# Altium schematic sheet HDMI.SchDoc
size A3; PageSetup: Record=PageOptions|CenterHorizontal=True|CenterVertical=True|PrintScale=0.73|XCorrection=1.00|YCorrection=1.00|PrintKind=0|BorderSize=5000000|LeftOffset=0|BottomOffset=0|Orientation=2|PaperLength=1000|PaperWidth=1000|Scale=100|PaperSource=7|PrintQuality=-4|MediaType=1|DitherType=10|PaperKind=A4|PrintScaleMode=1; Date: 27.05.2014; DrawnBy: luths8; Organization: BFH; Address1: Bern University of Applied Sciences; Address2: Engineering and Information Technology; Address3: Jlcoweg 1; Address4: CH-3400 Burgdorf; DocumentNumber: 10; Revision: 1.1; SheetNumber: 10; SheetTotal: 16; CurrentDate: 27.05.2014
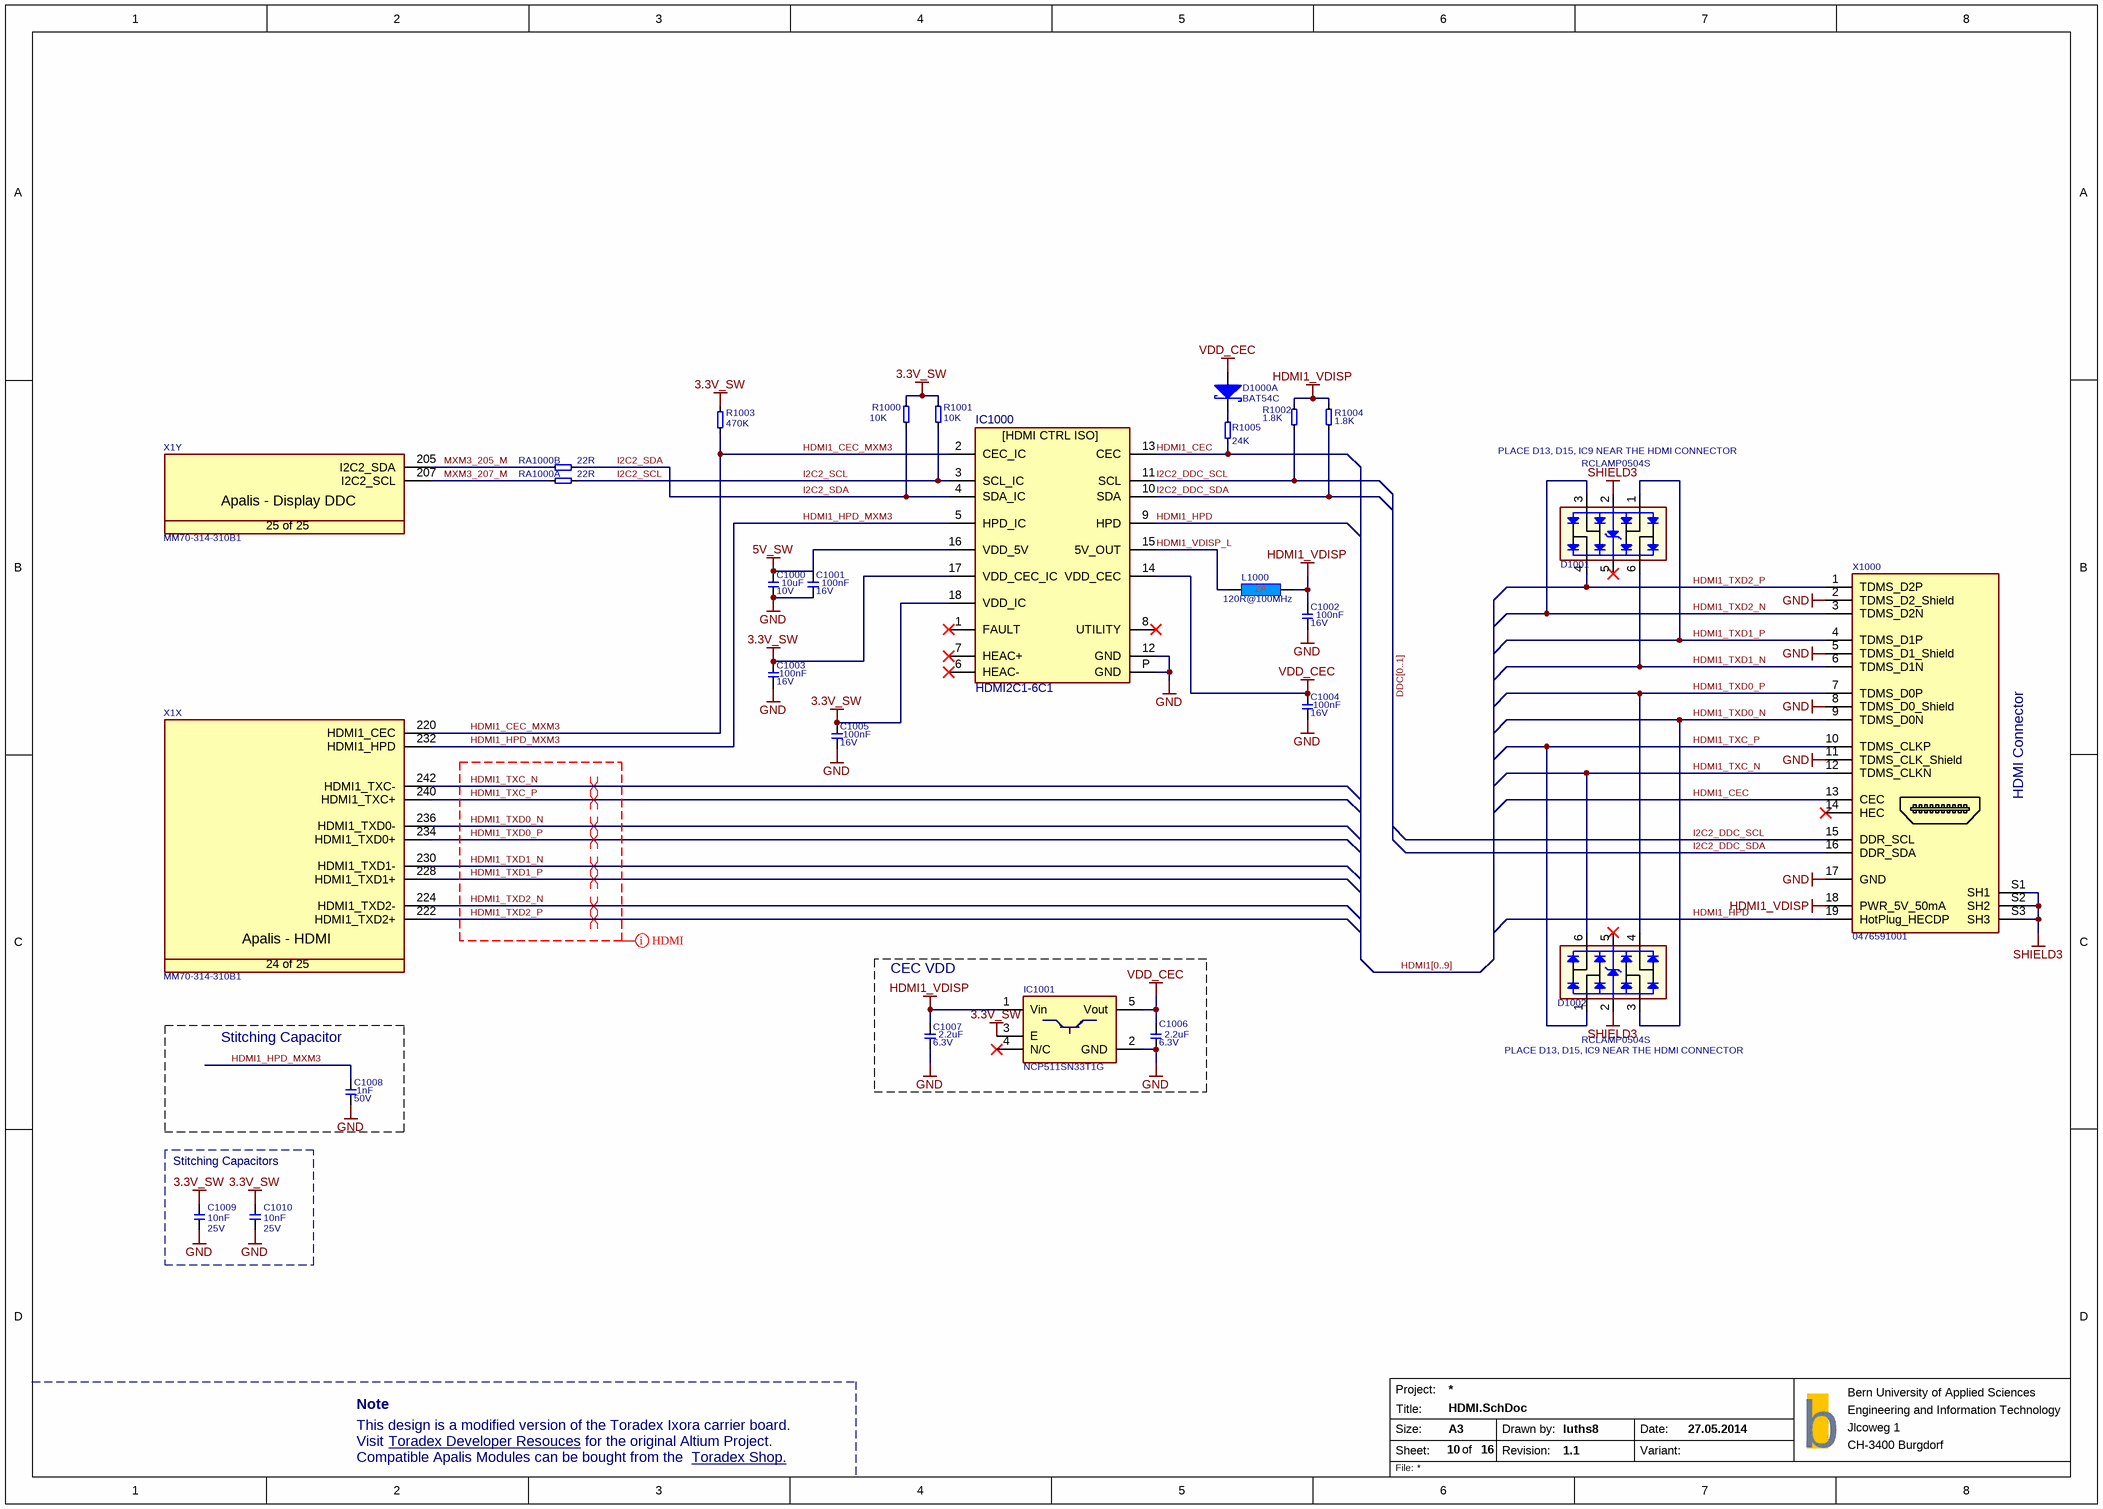
[diagram p0: HDMI.SchDoc]

## Parts
C1000  Rating: 10V  [SMD0603CAP]  (hidden comment: 10uF)
C1001  Rating: 16V  [SMD0603CAP]  (hidden comment: 100nF)
C1002  Rating: 16V  [SMD0603CAP]  (hidden comment: 100nF)
C1003  Rating: 16V  [SMD0603CAP]  (hidden comment: 100nF)
C1004  Rating: 16V  [SMD0603CAP]  (hidden comment: 100nF)
C1005  Rating: 16V  [SMD0603CAP]  (hidden comment: 100nF)
C1006  Rating: 6.3V  [SMD0603CAP]  (hidden comment: 2.2uF)
C1007  Rating: 6.3V  [SMD0603CAP]  (hidden comment: 2.2uF)
C1008  Rating: 50V  [SMD0603CAP]  (hidden comment: 1nF)
C1009  10nF  Rating: 25V  [SMD0603CAP]
C1010  10nF  Rating: 25V  [SMD0603CAP]
D1000  BAT54C  [SOT95P230X110-3N]  (part A of 2)
D1001  RCLAMP0504S  [T_SOT95P285X90-6N]
D1002  RCLAMP0504S  [T_SOT95P285X90-6N]
IC1000  HDMI2C1-6C1  [QFN18]
IC1001  NCP511SN33T1G  [SOT95P279X142-5N]
L1000  120R@100MHz  [INDC1608X95N]
R1000  10K  [SMD0603RES]
R1001  10K  [SMD0603RES]
R1002  1.8K  [SMD0603RES]
R1003  470K  [SMD0603RES]
R1004  1.8K  [SMD0603RES]
R1005  24K  [SMD0603RES]
RA1000  22R  [T_Resistor_Array_X4]  (parts A,B of 4)
X1  Manufacturer Part No.: MM70-314-310B1  [T_JAE_MM70-314-310B1]  (hidden comment: CON-JAE-MM70-314-310B1-314-0.5mm)  (parts X,Y of 25)
X1000  0476591001  [0476591001]

## Blocks framed on the sheet
CEC VDD: C1006 C1007 IC1001
Stitching Capacitor: C1008
Stitching Capacitors: C1009 C1010

## Nets
3.3V_SW: C1003.2 C1005.2 C1009.2 C1010.2 IC1000.17(VDD_CEC_IC) IC1000.18(VDD_IC) IC1001.3(E) R1000.2 R1001.2 R1003.2
5V_SW: C1000.2 C1001.1 IC1000.16(VDD_5V)
GND: C1000.1 C1001.2 C1002.1 C1003.1 C1004.1 C1005.1 C1006.1 C1007.1 C1008.1 C1009.1 C1010.1 IC1000.12(GND) IC1000.P(GND) IC1001.2(GND) X1000.2(TDMS_D2_Shield) X1000.5(TDMS_D1_Shield) X1000.8(TDMS_D0_Shield) X1000.11(TDMS_CLK_Shield) X1000.17(GND)
HDMI1_VDISP: C1002.2 C1007.2 IC1001.1(Vin) L1000.2 R1002.2 R1004.2 X1000.18(PWR_5V_50mA)
SHIELD3: D1001.2 D1002.2 X1000.S1(SH1) X1000.S2(SH2) X1000.S3(SH3)
VDD_CEC: C1004.2 C1006.2 D1000.1 IC1000.14(VDD_CEC) IC1001.5(Vout)
HDMI1_CEC: IC1000.13(CEC) R1005.1 X1000.13(CEC)
HDMI1_CEC_MXM3: IC1000.2(CEC_IC) R1003.1 X1.220(HDMI1_CEC)
HDMI1_HPD: IC1000.9(HPD) X1000.19(HotPlug_HECDP)
HDMI1_HPD_MXM3: C1008.2 IC1000.5(HPD_IC) X1.232(HDMI1_HPD)
HDMI1_TXC_N: D1002.6 X1.242(HDMI1_TXC-) X1000.12(TDMS_CLKN)
HDMI1_TXC_P: D1002.1 X1.240(HDMI1_TXC+) X1000.10(TDMS_CLKP)
HDMI1_TXD0_N: D1002.3 X1.236(HDMI1_TXD0-) X1000.9(TDMS_D0N)
HDMI1_TXD0_P: D1002.4 X1.234(HDMI1_TXD0+) X1000.7(TDMS_D0P)
HDMI1_TXD1_N: D1001.6 X1.230(HDMI1_TXD1-) X1000.6(TDMS_D1N)
HDMI1_TXD1_P: D1001.1 X1.228(HDMI1_TXD1+) X1000.4(TDMS_D1P)
HDMI1_TXD2_N: D1001.3 X1.224(HDMI1_TXD2-) X1000.3(TDMS_D2N)
HDMI1_TXD2_P: D1001.4 X1.222(HDMI1_TXD2+) X1000.1(TDMS_D2P)
HDMI1_VDISP_L: IC1000.15(5V_OUT) L1000.1
I2C2_DDC_SCL: IC1000.11(SCL) R1002.1 X1000.15(DDR_SCL)
I2C2_DDC_SDA: IC1000.10(SDA) R1004.1 X1000.16(DDR_SDA)
I2C2_SCL: IC1000.3(SCL_IC) R1001.1 RA1000.5
I2C2_SDA: IC1000.4(SDA_IC) R1000.1 RA1000.6
MXM3_205_M: RA1000.2 X1.205(I2C2_SDA)
MXM3_207_M: RA1000.1 X1.207(I2C2_SCL)
NetD1000_3: D1000.3 R1005.2

Not connected (* = marked no-connect by the designer): D1001 5*; D1002 5*; IC1000 1(FAULT)* 6(HEAC-)* 7(HEAC+)* 8(UTILITY)*; IC1001 4(N/C)*; X1000 14(HEC)*

## Buses and harness runs
bus DDC[0..1]
bus HDMI1[0..9]

## Layout directives
differential pair: HDMI1_TXC_N, HDMI1_TXC_P, HDMI1_TXD0_N, HDMI1_TXD0_P, HDMI1_TXD1_N, HDMI1_TXD1_P, HDMI1_TXD2_N, HDMI1_TXD2_P
net class HDMI: HDMI1_TXC_N, HDMI1_TXC_P, HDMI1_TXD0_N, HDMI1_TXD0_P, HDMI1_TXD1_N, HDMI1_TXD1_P, HDMI1_TXD2_N, HDMI1_TXD2_P

## Notes on the sheet
- (near D1001) PLACE D13, D15, IC9 NEAR THE HDMI CONNECTOR
- (near X1000) HDMI Connector
- (near D1002) PLACE D13, D15, IC9 NEAR THE HDMI CONNECTOR
- Note
- This design is a modified version of the Toradex Ixora carrier board.
- Visit
- Compatible Apalis Modules can be bought from the
- Toradex Developer Resouces <https://developer.toradex.com/products/ixora-carrier-board>
- for the original Altium Project.
- Toradex Shop. <https://www.toradex.com/order-now/apalis-arm-family>
- Project:
- Size:
- Sheet:
- Title:
- A3
- of
- Drawn by:
- Revision:
- Date:
- Variant:
- b
- File:
- (in symbol CON-JAE-MM70-314-310B1-314-0.5mm, part X) Apalis - HDMI; 24 of 25
- (in symbol CON-JAE-MM70-314-310B1-314-0.5mm, part Y) Apalis - Display DDC; 25 of 25
- (in symbol HDMI2C1-6C1) [HDMI CTRL ISO]

## Library data of the parts
C1000 = C-X5R-10uF-10V-20%-0603: Capacitor Ceramic X5R 10uF 10V 20% 0603; Tolerance: 20%; Type: X5R; Value: 10uF
C1001-C1005 = C-X7R-100nF-16V-10%-0402: Capacitor Ceramic X7R 100nF 16V 10% 0603; Tolerance: 10%; Type: X7R; Value: 100nF
C1006 C1007 = C-X5R-2.2uF-6.3V-20%-0603: Capacitor Ceramic X5R 2.2uF 6.3V 20% 0603; Tolerance: 20%; Type: X5R; Value: 2.2uF
C1008 = C-X7R-1nF-50V-10%-0402: Capacitor Ceramic X7R 1nF 50V 10% 0603; Tolerance: 10%; Type: X7R; Value: 1nF
C1009 C1010 = C-X7R-10nF-25V-10%-0603: Capacitor Ceramic X7R 10nF 25V 10% 0603; Tolerance: 10%; Type: X7R; Value: 10nF
D1000 = D-Philips-BAT54C-Schottky-30V-200mA: BAT54 Schottky Diode; Manufacturer: Philips; Manufacturer Part Number: BAT54C
D1001 D1002 = D-Semtech-RClamp0504S: TVS Array low cap; Manufacturer Name: Semtech; Manufacturer Part No.: RCLAMP0504S
IC1000 = HDMI2C1-6C1: HDMI ESD protection, level shifter and backdrive protection; Manufacturer Part No.: HDMI2C1-6C1
IC1001 = IC-ON-NCP511SN33T1G: NCP511SN33T1G LDO Regulator; Manufacturer Name: ON Semiconductor; Manufacturer Part No.: NCP511SN33T1G
L1000 = L-120R@100MHz-2A-25%-0603: 120R@100MHz 2A EMI FILTER; Tolerance: 25%; Rating: 2A; Value: 120R@100MHz
R1000 R1001 = R-10KR-63mW-1%-0603: Resistor 10 Kohm 63mW 1% 0603; Value: 10KR; Rating: 63mW; Tolerance: 1%
R1002 R1004 = R-1.8KR-63mW-5%-0603: Resistor 1.8 Kohm 63mW 5% 0603; Value: 1.8KR; Rating: 63mW; Tolerance: 5%
R1003 = R-470KR-63mW-5%-0402: Resistor 470 Kohm 63mW 5% 0603; Value: 470KR; Rating: 63mW; Tolerance: 5%
R1005 = R-24KR-63mW-1%-0402: Resistor 24 Kohm 63mW 1% 0603; Value: 24KR; Rating: 63mW; Tolerance: 1%
RA1000 = RA-22R-63mW-5%-1206-div: Resistor Array 22 R 63mW 5% 1206; Tolerance: 5%; Power Dissipation: 63mW; Value: 22R
X1 = CON-JAE-MM70-314-310B1-314-0.5mm: MXM3 Connector; Manufacturer Name: JAE; No. of ways: 314
X1000 = CON-Molex-0476591001: HDMI Connector Vertical; Manufacturer: Molex; Manufacturer Part No.: 0476591001; System: Connector